# EAGLE schematic motor (EAGLE 5.07)
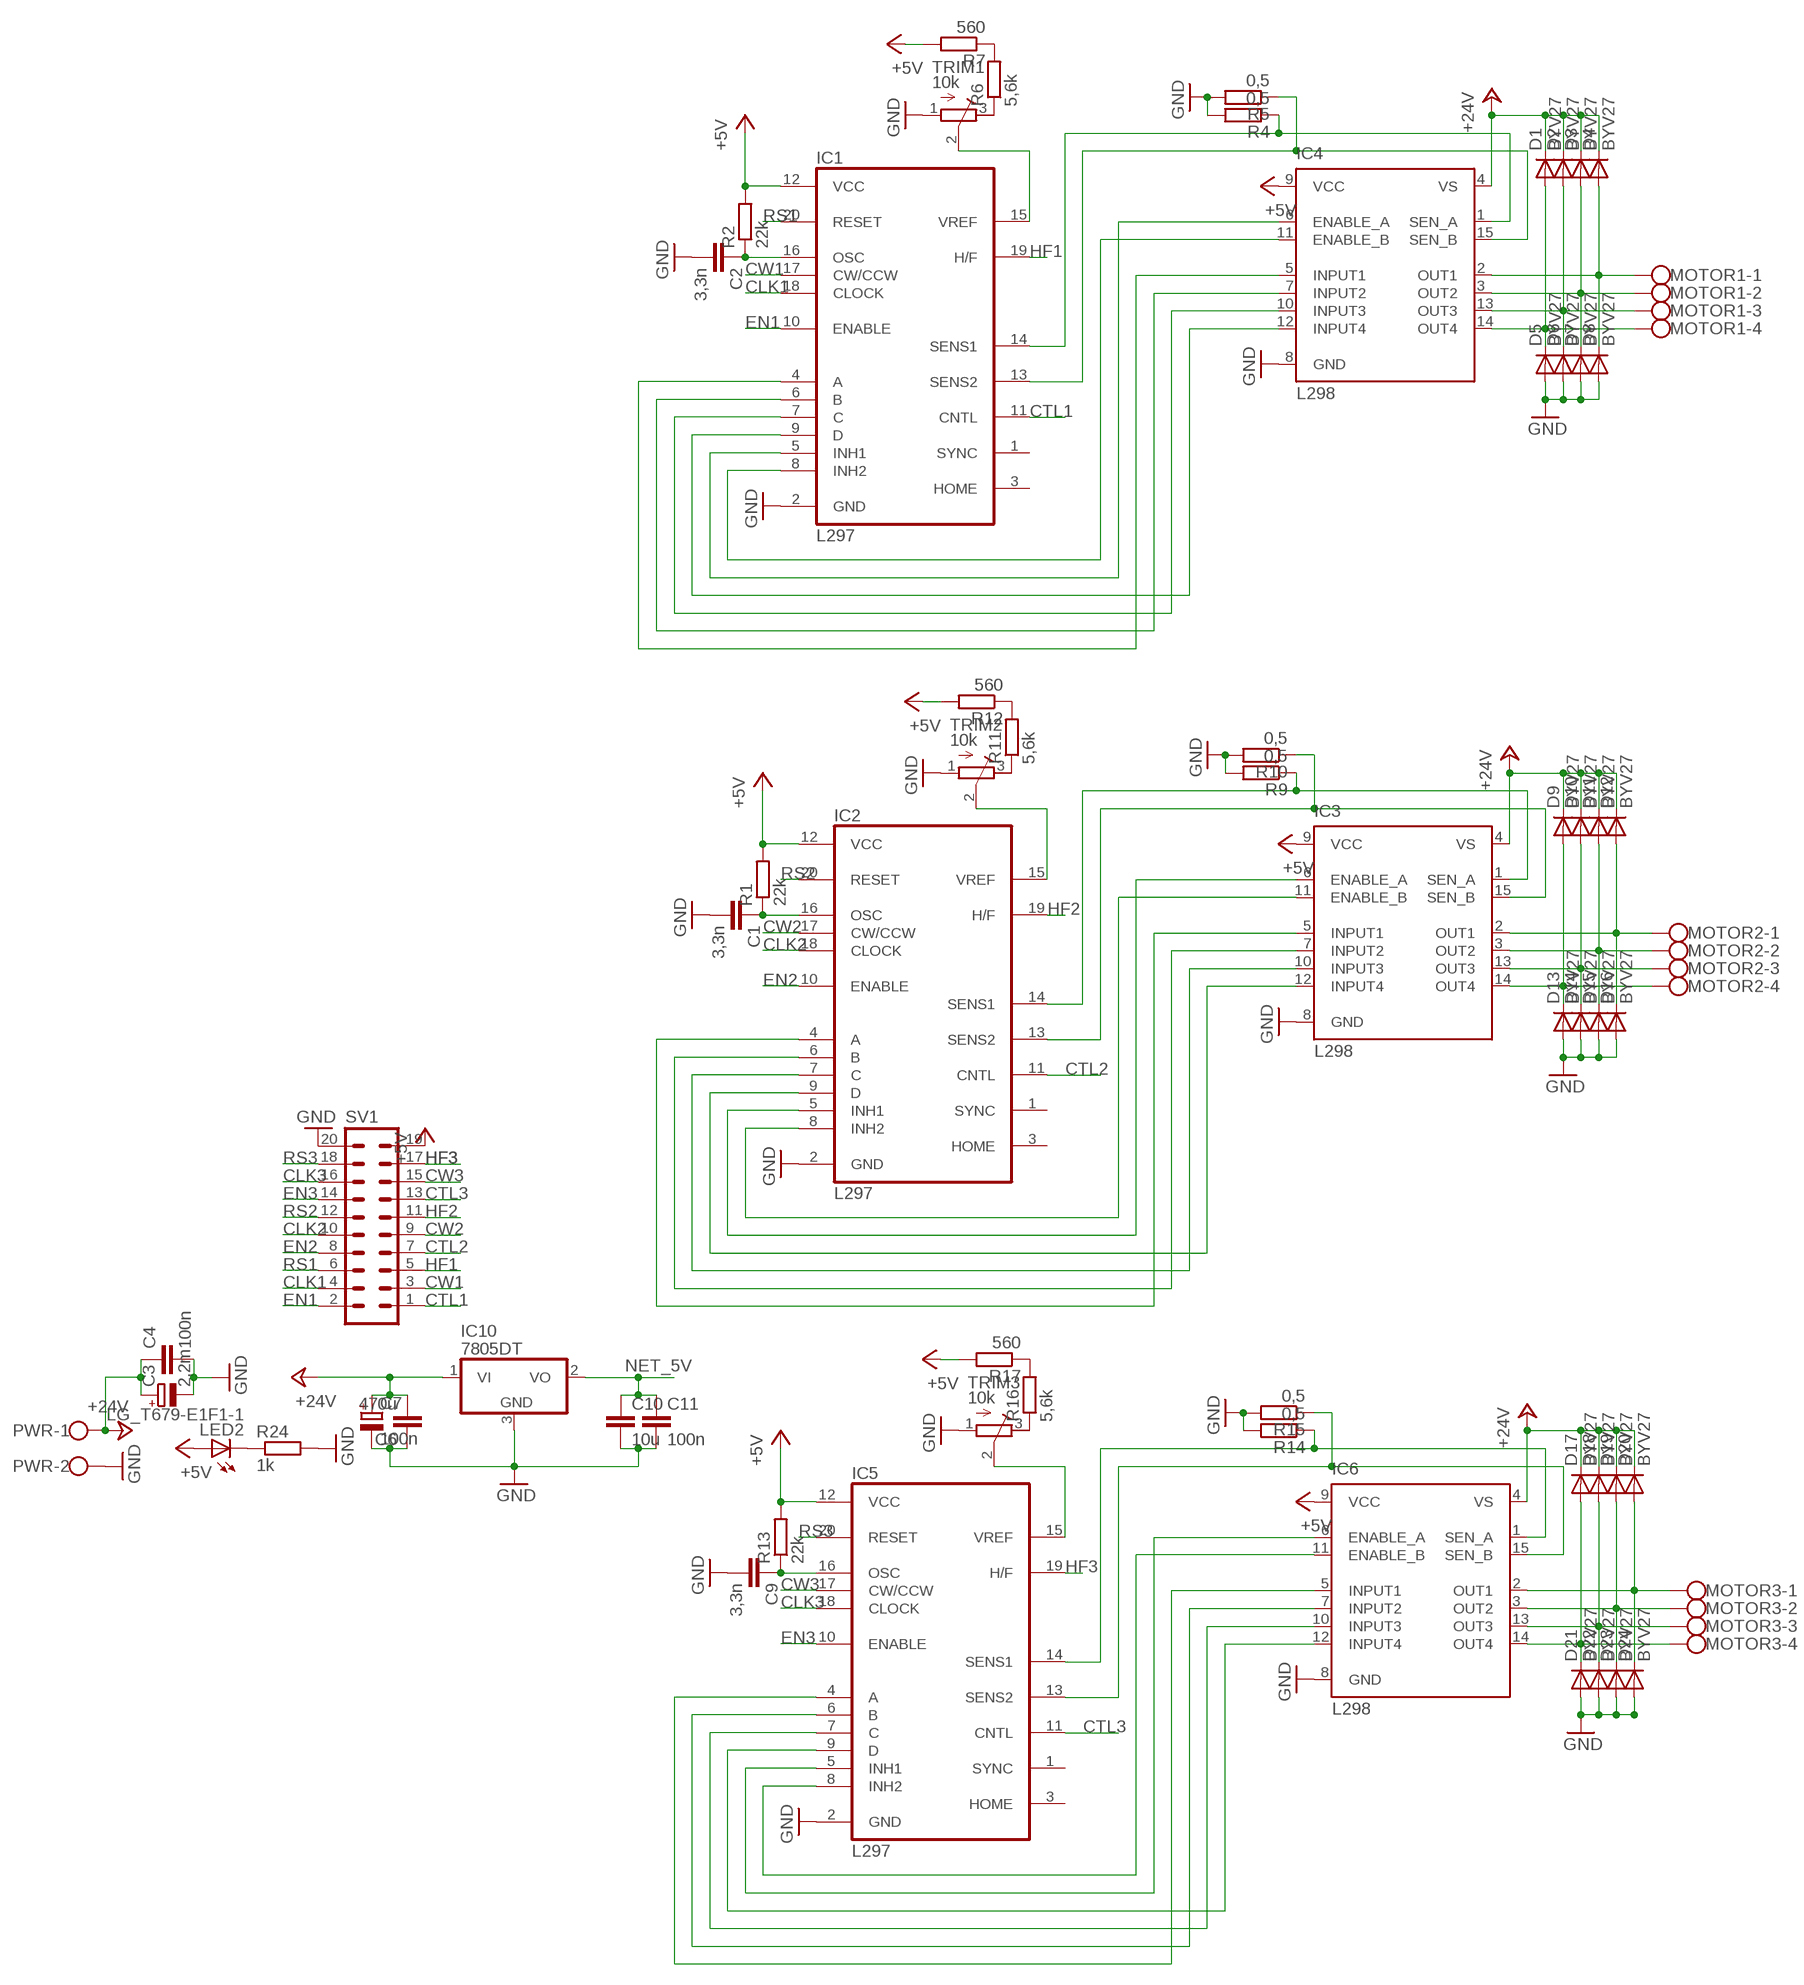
[diagram p0: schematic, sheet 1]

## Parts
C1  3,3n  C-EUC0805K  [C0805K]
C2  3,3n  C-EUC0805K  [C0805K]
C3  2,2m  CPOL-EUE7.5-18  [E7,5-18]
C4  100n  C-EUC0805K  [C0805K]
C6  470u  C-EUC1206K  [C1206K]
C7  100n  CPOL-EUE3.5-8  [E3,5-8]
C9  3,3n  C-EUC0805K  [C0805K]
C10  10u  C-EUC1206K  [C1206K]
C11  100n  C-EUC1206K  [C1206K]
D1  BYV27  [SOD57-10]
D2  BYV27  [SOD57-10]
D3  BYV27  [SOD57-10]
D4  BYV27  [SOD57-10]
D5  BYV27  [SOD57-10]
D6  BYV27  [SOD57-10]
D7  BYV27  [SOD57-10]
D8  BYV27  [SOD57-10]
D9  BYV27  [SOD57-10]
D10  BYV27  [SOD57-10]
D11  BYV27  [SOD57-10]
D12  BYV27  [SOD57-10]
D13  BYV27  [SOD57-10]
D14  BYV27  [SOD57-10]
D15  BYV27  [SOD57-10]
D16  BYV27  [SOD57-10]
D17  BYV27  [SOD57-10]
D18  BYV27  [SOD57-10]
D19  BYV27  [SOD57-10]
D20  BYV27  [SOD57-10]
D21  BYV27  [SOD57-10]
D22  BYV27  [SOD57-10]
D23  BYV27  [SOD57-10]
D24  BYV27  [SOD57-10]
IC1  L297  [DIL20]
IC2  L297  [DIL20]
IC3  L298  [MULTIWATT-15]
IC4  L298  [MULTIWATT-15]
IC5  L297  [DIL20]
IC6  L298  [MULTIWATT-15]
IC10  7805DT  [TO252]
LED2  LG_T679-E1F1-1  [PLCC2]
MOTOR1  W237-4  [W237-4]
MOTOR2  W237-4  [W237-4]
MOTOR3  W237-4  [W237-4]
PWR  W237-102  [W237-102]
R1  22k  R-EU_R1206  [R1206]
R2  22k  R-EU_R1206  [R1206]
R4  0,5  R-EU_0817/7V  [P0817V]
R5  0,5  R-EU_0817/7V  [P0817V]
R6  5,6k  R-EU_R1206  [R1206]
R7  560  R-EU_R1206  [R1206]
R9  0,5  R-EU_0817/7V  [P0817V]
R10  0,5  R-EU_0817/7V  [P0817V]
R11  5,6k  R-EU_R1206  [R1206]
R12  560  R-EU_R1206  [R1206]
R13  22k  R-EU_R1206  [R1206]
R14  0,5  R-EU_0817/7V  [P0817V]
R15  0,5  R-EU_0817/7V  [P0817V]
R16  5,6k  R-EU_R1206  [R1206]
R17  560  R-EU_R1206  [R1206]
R24  1k  R-EU_R1206  [R1206]
SV1  ML20  [ML20]
TRIM1  10k  R-TRIMM3339P  [RTRIM3339P]
TRIM2  10k  R-TRIMM3339P  [RTRIM3339P]
TRIM3  10k  R-TRIMM3339P  [RTRIM3339P]

## Nets
+5V: IC1.12(VCC) IC2.12(VCC) IC3.9(VCC) IC4.9(VCC) IC5.12(VCC) IC6.9(VCC) LED2.A R1.2 R2.2 R7.2 R12.2 R13.2 R17.2 SV1.19
+24V: C3.+ C4.1 C6.2 C7.+ D1.C D2.C D3.C D4.C D9.C D10.C D11.C D12.C D17.C D18.C D19.C D20.C IC3.4(VS) IC4.4(VS) IC6.4(VS) IC10.1(VI) PWR.1
CLK1: IC1.18(CLOCK) SV1.4
CLK2: IC2.18(CLOCK) SV1.10
CLK3: IC5.18(CLOCK) SV1.16
CTL1: IC1.11(CNTL) SV1.1
CTL2: IC2.11(CNTL) SV1.7
CTL3: IC5.11(CNTL) SV1.13
CW1: IC1.17(CW/CCW) SV1.3
CW2: IC2.17(CW/CCW) SV1.9
CW3: IC5.17(CW/CCW) SV1.15
EN1: IC1.10(ENABLE) SV1.2
EN2: IC2.10(ENABLE) SV1.8
EN3: IC5.10(ENABLE) SV1.14
GND: C1.2 C2.2 C3.- C4.2 C6.1 C7.- C9.2 C10.2 C11.2 D5.A D6.A D7.A D8.A D13.A D14.A D15.A D16.A D21.A D22.A D23.A D24.A IC1.2(GND) IC2.2(GND) IC3.8(GND) IC4.8(GND) IC5.2(GND) IC6.8(GND) IC10.3(GND) PWR.2 R4.2 R5.2 R9.2 R10.2 R14.2 R15.2 R24.2 SV1.20 TRIM1.1(E) TRIM2.1(E) TRIM3.1(E)
HF1: IC1.19(H/F) SV1.5
HF2: IC2.19(H/F) SV1.11
HF3: IC5.19(H/F) SV1.17
N$1: IC1.9(D) IC4.12(INPUT4)
N$2: IC1.7(C) IC4.10(INPUT3)
N$3: IC1.6(B) IC4.7(INPUT2)
N$4: IC1.4(A) IC4.5(INPUT1)
N$6: C2.1 IC1.16(OSC) R2.1
N$7: IC1.5(INH1) IC4.6(ENABLE_A)
N$8: IC1.8(INH2) IC4.11(ENABLE_B)
N$9: IC2.9(D) IC3.12(INPUT4)
N$10: IC2.7(C) IC3.10(INPUT3)
N$11: IC2.6(B) IC3.7(INPUT2)
N$12: IC1.14(SENS1) IC4.1(SEN_A) R4.1
N$13: IC1.15(VREF) TRIM1.2(S)
N$14: D4.A D8.C IC4.2(OUT1) MOTOR1.1
N$15: D1.A D5.C IC4.14(OUT4) MOTOR1.4
N$16: D2.A D6.C IC4.13(OUT3) MOTOR1.3
N$17: D3.A D7.C IC4.3(OUT2) MOTOR1.2
N$19: IC1.13(SENS2) IC4.15(SEN_B) R5.1
N$20: IC2.4(A) IC3.5(INPUT1)
N$21: C1.1 IC2.16(OSC) R1.1
N$22: IC2.5(INH1) IC3.6(ENABLE_A)
N$23: R6.1 TRIM1.3(A)
N$24: R6.2 R7.1
N$26: IC2.8(INH2) IC3.11(ENABLE_B)
N$30: IC2.14(SENS1) IC3.1(SEN_A) R9.1
N$31: D12.A D16.C IC3.2(OUT1) MOTOR2.1
N$32: D9.A D13.C IC3.14(OUT4) MOTOR2.4
N$33: D10.A D14.C IC3.13(OUT3) MOTOR2.3
N$34: D11.A D15.C IC3.3(OUT2) MOTOR2.2
N$35: IC2.13(SENS2) IC3.15(SEN_B) R10.1
N$36: IC2.15(VREF) TRIM2.2(S)
N$37: R11.1 TRIM2.3(A)
N$38: R11.2 R12.1
N$39: IC5.9(D) IC6.12(INPUT4)
N$40: IC5.7(C) IC6.10(INPUT3)
N$41: IC5.6(B) IC6.7(INPUT2)
N$42: IC5.4(A) IC6.5(INPUT1)
N$43: C9.1 IC5.16(OSC) R13.1
N$44: IC5.5(INH1) IC6.6(ENABLE_A)
N$45: IC5.8(INH2) IC6.11(ENABLE_B)
N$46: IC5.14(SENS1) IC6.1(SEN_A) R14.1
N$47: D20.A D24.C IC6.2(OUT1) MOTOR3.1
N$48: D17.A D21.C IC6.14(OUT4) MOTOR3.4
N$49: D18.A D22.C IC6.13(OUT3) MOTOR3.3
N$50: D19.A D23.C IC6.3(OUT2) MOTOR3.2
N$51: IC5.13(SENS2) IC6.15(SEN_B) R15.1
N$52: IC5.15(VREF) TRIM3.2(S)
N$53: R16.1 TRIM3.3(A)
N$54: R16.2 R17.1
N$64: LED2.C R24.1
NET_5V: C10.1 C11.1 IC10.2(VO)
RS1: IC1.20(RESET) SV1.6
RS2: IC2.20(RESET) SV1.12
RS3: IC5.20(RESET) SV1.18
Unconnected: IC1.1(SYNC) IC1.3(HOME) IC2.1(SYNC) IC2.3(HOME) IC5.1(SYNC) IC5.3(HOME)

## Library data of the parts
C1 C2 C4 C6 C9-C11 = rcl:C-EU: CAPACITOR, European symbol
C3 C7 = rcl:CPOL-EU: POLARIZED CAPACITOR, European symbol
D1-D24 = diode:BYV27: DIODE ultra fast
IC1 IC2 IC5 = st-microelectronics:L297: STEPPER MOTOR CONTROLLER
IC3 IC4 IC6 = st-microelectronics:L298: DUAL FULL-BRIDGE DRIVER
IC10 = linear:78*: Positive VOLTAGE REGULATOR Source: http://cache.national.com/ds/LM/LM78L05.pdf http://www.fairchildsemi.com/ds/LM/LM7805.pdf
LED2 = led:*_T679-?-1: LC TOPLED® Low Current LED Source: http://catalog.osram-os.com .. LG_LS_LY_T679_OBS.pdf; COLOR: green
MOTOR1-MOTOR3 = con-wago-500:W237-4: WAGO SCREW CLAMP
PWR = con-wago-500:W237-102: WAGO SCREW CLAMP
R1 R2 R4-R7 R9-R17 R24 = rcl:R-EU_: RESISTOR, European symbol
SV1 = con-ml:ML20: HARTING
TRIM1-TRIM3 = rcl:R-TRIMM: Trimm resistor